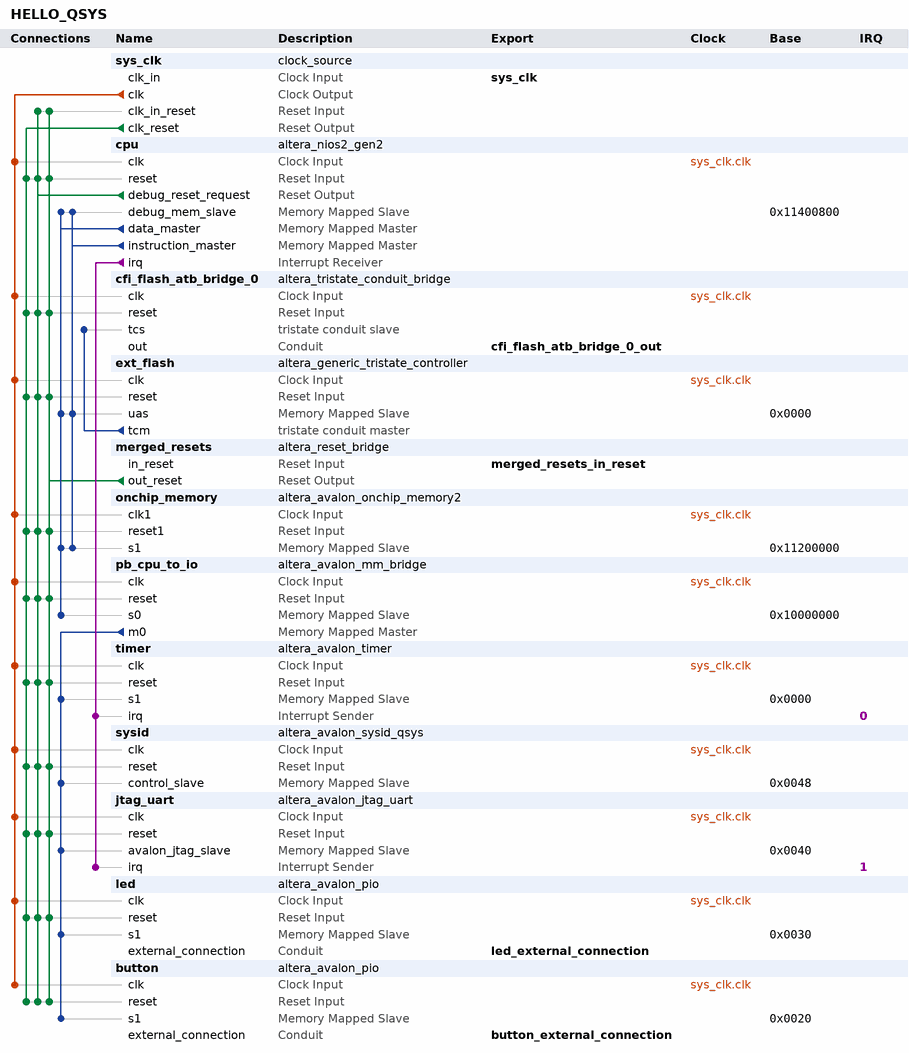
[diagram p0: system contents]
# Platform Designer (Qsys) system HELLO_QSYS, Stratix V 5SGXEA7N2F45C2
# Parameters at their usual value, and those the tool derives, are not listed.
package require -exact qsys 16.1
create_system HELLO_QSYS
set_project_property DEVICE_FAMILY {Stratix V}
set_project_property DEVICE 5SGXEA7N2F45C2

add_instance sys_clk clock_source 16.1
set_instance_parameter_value sys_clk clockFrequency 50000000

add_instance cpu altera_nios2_gen2 16.1
set_instance_parameter_value cpu dcache_size 32768
set_instance_parameter_value cpu exceptionOffset 288
set_instance_parameter_value cpu exceptionSlave onchip_memory.s1
set_instance_parameter_value cpu icache_size 32768
set_instance_parameter_value cpu impl Fast
set_instance_parameter_value cpu resetOffset 76808192
set_instance_parameter_value cpu resetSlave ext_flash.uas
set_instance_parameter_value cpu setting_activateTrace true

add_instance cfi_flash_atb_bridge_0 altera_tristate_conduit_bridge 16.1

add_instance ext_flash altera_generic_tristate_controller 16.1
set_instance_parameter_value ext_flash ACTIVE_LOW_BEGINTRANSFER 0
set_instance_parameter_value ext_flash ACTIVE_LOW_BYTEENABLE 0
set_instance_parameter_value ext_flash ACTIVE_LOW_OUTPUTENABLE 0
set_instance_parameter_value ext_flash ACTIVE_LOW_READ 1
set_instance_parameter_value ext_flash CHIPSELECT_THROUGH_READLATENCY 0
set_instance_parameter_value ext_flash INTERFACE_ASSIGNMENT_KEYS embeddedsw.configuration.isFlash,embeddedsw.configuration.isMemoryDevice,embeddedsw.configuration.isNonVolatileStorage
set_instance_parameter_value ext_flash INTERFACE_ASSIGNMENT_VALUES 1,1,1
set_instance_parameter_value ext_flash MODULE_ASSIGNMENT_KEYS embeddedsw.configuration.hwClassnameDriverSupportList,embeddedsw.configuration.hwClassnameDriverSupportDefault,embeddedsw.CMacro.SETUP_VALUE,embeddedsw.CMacro.WAIT_VALUE,embeddedsw.CMacro.HOLD_VALUE,embeddedsw.CMacro.TIMING_UNITS,embeddedsw.CMacro.SIZE,embeddedsw.memoryInfo.MEM_INIT_DATA_WIDTH,embeddedsw.memoryInfo.HAS_BYTE_LANE,embeddedsw.memoryInfo.IS_FLASH,embeddedsw.memoryInfo.GENERATE_DAT_SYM,embeddedsw.memoryInfo.GENERATE_FLASH,embeddedsw.memoryInfo.DAT_SYM_INSTALL_DIR,embeddedsw.memoryInfo.FLASH_INSTALL_DIR
set_instance_parameter_value ext_flash MODULE_ASSIGNMENT_VALUES altera_avalon_lan91c111:altera_avalon_cfi_flash1616,altera_avalon_cfi_flash1616,33,144,33,ns,268435456u,32,1,1,1,1,SIM_DIR,APP_DIR
set_instance_parameter_value ext_flash TCM_ADDRESS_W 28
set_instance_parameter_value ext_flash TCM_BYTEENABLE_W 4
set_instance_parameter_value ext_flash TCM_DATA_HOLD 33
set_instance_parameter_value ext_flash TCM_DATA_W 32
set_instance_parameter_value ext_flash TCM_MAX_PENDING_READ_TRANSACTIONS 3
set_instance_parameter_value ext_flash TCM_READLATENCY 2
set_instance_parameter_value ext_flash TCM_READ_WAIT 144
set_instance_parameter_value ext_flash TCM_SETUP_WAIT 33
set_instance_parameter_value ext_flash TCM_SYMBOLS_PER_WORD 4
set_instance_parameter_value ext_flash TCM_TIMING_UNITS 0
set_instance_parameter_value ext_flash TCM_TURNAROUND_TIME 2
set_instance_parameter_value ext_flash TCM_WRITE_WAIT 144
set_instance_parameter_value ext_flash USE_BEGINTRANSFER 0
set_instance_parameter_value ext_flash USE_BYTEENABLE 0
set_instance_parameter_value ext_flash USE_OUTPUTENABLE 0
set_instance_parameter_value ext_flash USE_READ 1

add_instance merged_resets altera_reset_bridge 16.1
set_instance_parameter_value merged_resets ACTIVE_LOW_RESET 1
set_instance_parameter_value merged_resets SYNCHRONOUS_EDGES none

add_instance onchip_memory altera_avalon_onchip_memory2 16.1
set_instance_parameter_value onchip_memory dataWidth 32
set_instance_parameter_value onchip_memory dualPort false
set_instance_parameter_value onchip_memory initMemContent true
set_instance_parameter_value onchip_memory initializationFileName onchip_memory
set_instance_parameter_value onchip_memory memorySize 1572864

add_instance pb_cpu_to_io altera_avalon_mm_bridge 16.1
set_instance_parameter_value pb_cpu_to_io ADDRESS_UNITS SYMBOLS
set_instance_parameter_value pb_cpu_to_io ADDRESS_WIDTH 11
set_instance_parameter_value pb_cpu_to_io DATA_WIDTH 32
set_instance_parameter_value pb_cpu_to_io MAX_PENDING_RESPONSES 19
set_instance_parameter_value pb_cpu_to_io USE_AUTO_ADDRESS_WIDTH 0

add_instance timer altera_avalon_timer 16.1
set_instance_parameter_value timer period 10
set_instance_parameter_value timer periodUnits MSEC

add_instance sysid altera_avalon_sysid_qsys 16.1
set_instance_parameter_value sysid id 0

add_instance jtag_uart altera_avalon_jtag_uart 16.1
set_instance_parameter_value jtag_uart simInteractiveOptions INTERACTIVE_ASCII_OUTPUT

add_instance led altera_avalon_pio 16.1
set_instance_parameter_value led direction Output
set_instance_parameter_value led resetValue 15
set_instance_parameter_value led width 4

add_instance button altera_avalon_pio 16.1
set_instance_parameter_value button direction Input
set_instance_parameter_value button width 2

# connections
add_connection sys_clk.clk button.clk clock
add_connection sys_clk.clk cfi_flash_atb_bridge_0.clk clock
add_connection sys_clk.clk cpu.clk clock
add_connection sys_clk.clk ext_flash.clk clock
add_connection sys_clk.clk jtag_uart.clk clock
add_connection sys_clk.clk led.clk clock
add_connection sys_clk.clk onchip_memory.clk1 clock
add_connection sys_clk.clk pb_cpu_to_io.clk clock
add_connection sys_clk.clk sysid.clk clock
add_connection sys_clk.clk timer.clk clock
add_connection cpu.debug_reset_request button.reset reset
add_connection cpu.debug_reset_request cfi_flash_atb_bridge_0.reset reset
add_connection cpu.debug_reset_request cpu.reset reset
add_connection cpu.debug_reset_request ext_flash.reset reset
add_connection cpu.debug_reset_request jtag_uart.reset reset
add_connection cpu.debug_reset_request led.reset reset
add_connection cpu.debug_reset_request onchip_memory.reset1 reset
add_connection cpu.debug_reset_request pb_cpu_to_io.reset reset
add_connection cpu.debug_reset_request sys_clk.clk_in_reset reset
add_connection cpu.debug_reset_request sysid.reset reset
add_connection cpu.debug_reset_request timer.reset reset
add_connection merged_resets.out_reset button.reset reset
add_connection merged_resets.out_reset cfi_flash_atb_bridge_0.reset reset
add_connection merged_resets.out_reset cpu.reset reset
add_connection merged_resets.out_reset ext_flash.reset reset
add_connection merged_resets.out_reset jtag_uart.reset reset
add_connection merged_resets.out_reset led.reset reset
add_connection merged_resets.out_reset onchip_memory.reset1 reset
add_connection merged_resets.out_reset pb_cpu_to_io.reset reset
add_connection merged_resets.out_reset sys_clk.clk_in_reset reset
add_connection merged_resets.out_reset sysid.reset reset
add_connection merged_resets.out_reset timer.reset reset
add_connection sys_clk.clk_reset button.reset reset
add_connection sys_clk.clk_reset cfi_flash_atb_bridge_0.reset reset
add_connection sys_clk.clk_reset cpu.reset reset
add_connection sys_clk.clk_reset ext_flash.reset reset
add_connection sys_clk.clk_reset jtag_uart.reset reset
add_connection sys_clk.clk_reset led.reset reset
add_connection sys_clk.clk_reset onchip_memory.reset1 reset
add_connection sys_clk.clk_reset pb_cpu_to_io.reset reset
add_connection sys_clk.clk_reset sysid.reset reset
add_connection sys_clk.clk_reset timer.reset reset
add_connection cpu.data_master cpu.debug_mem_slave avalon
set_connection_parameter_value cpu.data_master/cpu.debug_mem_slave baseAddress 0x11400800
add_connection cpu.data_master ext_flash.uas avalon
set_connection_parameter_value cpu.data_master/ext_flash.uas baseAddress 0x0000
add_connection cpu.data_master onchip_memory.s1 avalon
set_connection_parameter_value cpu.data_master/onchip_memory.s1 baseAddress 0x11200000
add_connection cpu.data_master pb_cpu_to_io.s0 avalon
set_connection_parameter_value cpu.data_master/pb_cpu_to_io.s0 baseAddress 0x10000000
add_connection cpu.instruction_master cpu.debug_mem_slave avalon
set_connection_parameter_value cpu.instruction_master/cpu.debug_mem_slave baseAddress 0x11400800
add_connection cpu.instruction_master ext_flash.uas avalon
set_connection_parameter_value cpu.instruction_master/ext_flash.uas baseAddress 0x0000
add_connection cpu.instruction_master onchip_memory.s1 avalon
set_connection_parameter_value cpu.instruction_master/onchip_memory.s1 baseAddress 0x11200000
add_connection pb_cpu_to_io.m0 button.s1 avalon
set_connection_parameter_value pb_cpu_to_io.m0/button.s1 baseAddress 0x0020
add_connection pb_cpu_to_io.m0 jtag_uart.avalon_jtag_slave avalon
set_connection_parameter_value pb_cpu_to_io.m0/jtag_uart.avalon_jtag_slave baseAddress 0x0040
add_connection pb_cpu_to_io.m0 led.s1 avalon
set_connection_parameter_value pb_cpu_to_io.m0/led.s1 baseAddress 0x0030
add_connection pb_cpu_to_io.m0 sysid.control_slave avalon
set_connection_parameter_value pb_cpu_to_io.m0/sysid.control_slave baseAddress 0x0048
add_connection pb_cpu_to_io.m0 timer.s1 avalon
set_connection_parameter_value pb_cpu_to_io.m0/timer.s1 baseAddress 0x0000
add_connection cpu.irq jtag_uart.irq interrupt
set_connection_parameter_value cpu.irq/jtag_uart.irq irqNumber 1
add_connection cpu.irq timer.irq interrupt
set_connection_parameter_value cpu.irq/timer.irq irqNumber 0
add_connection ext_flash.tcm cfi_flash_atb_bridge_0.tcs tristate_conduit

# exported interfaces
add_interface button_external_connection conduit end
set_interface_property button_external_connection EXPORT_OF button.external_connection
add_interface cfi_flash_atb_bridge_0_out conduit end
set_interface_property cfi_flash_atb_bridge_0_out EXPORT_OF cfi_flash_atb_bridge_0.out
add_interface led_external_connection conduit end
set_interface_property led_external_connection EXPORT_OF led.external_connection
add_interface merged_resets_in_reset reset sink
set_interface_property merged_resets_in_reset EXPORT_OF merged_resets.in_reset
add_interface sys_clk clock sink
set_interface_property sys_clk EXPORT_OF sys_clk.clk_in

set_interconnect_requirement {$system} qsys_mm.clockCrossingAdapter HANDSHAKE
set_interconnect_requirement {$system} qsys_mm.maxAdditionalLatency 0

save_system HELLO_QSYS.qsys
